# Altium project SmartMeter-multi.PrjPCB (part 1 of 2)
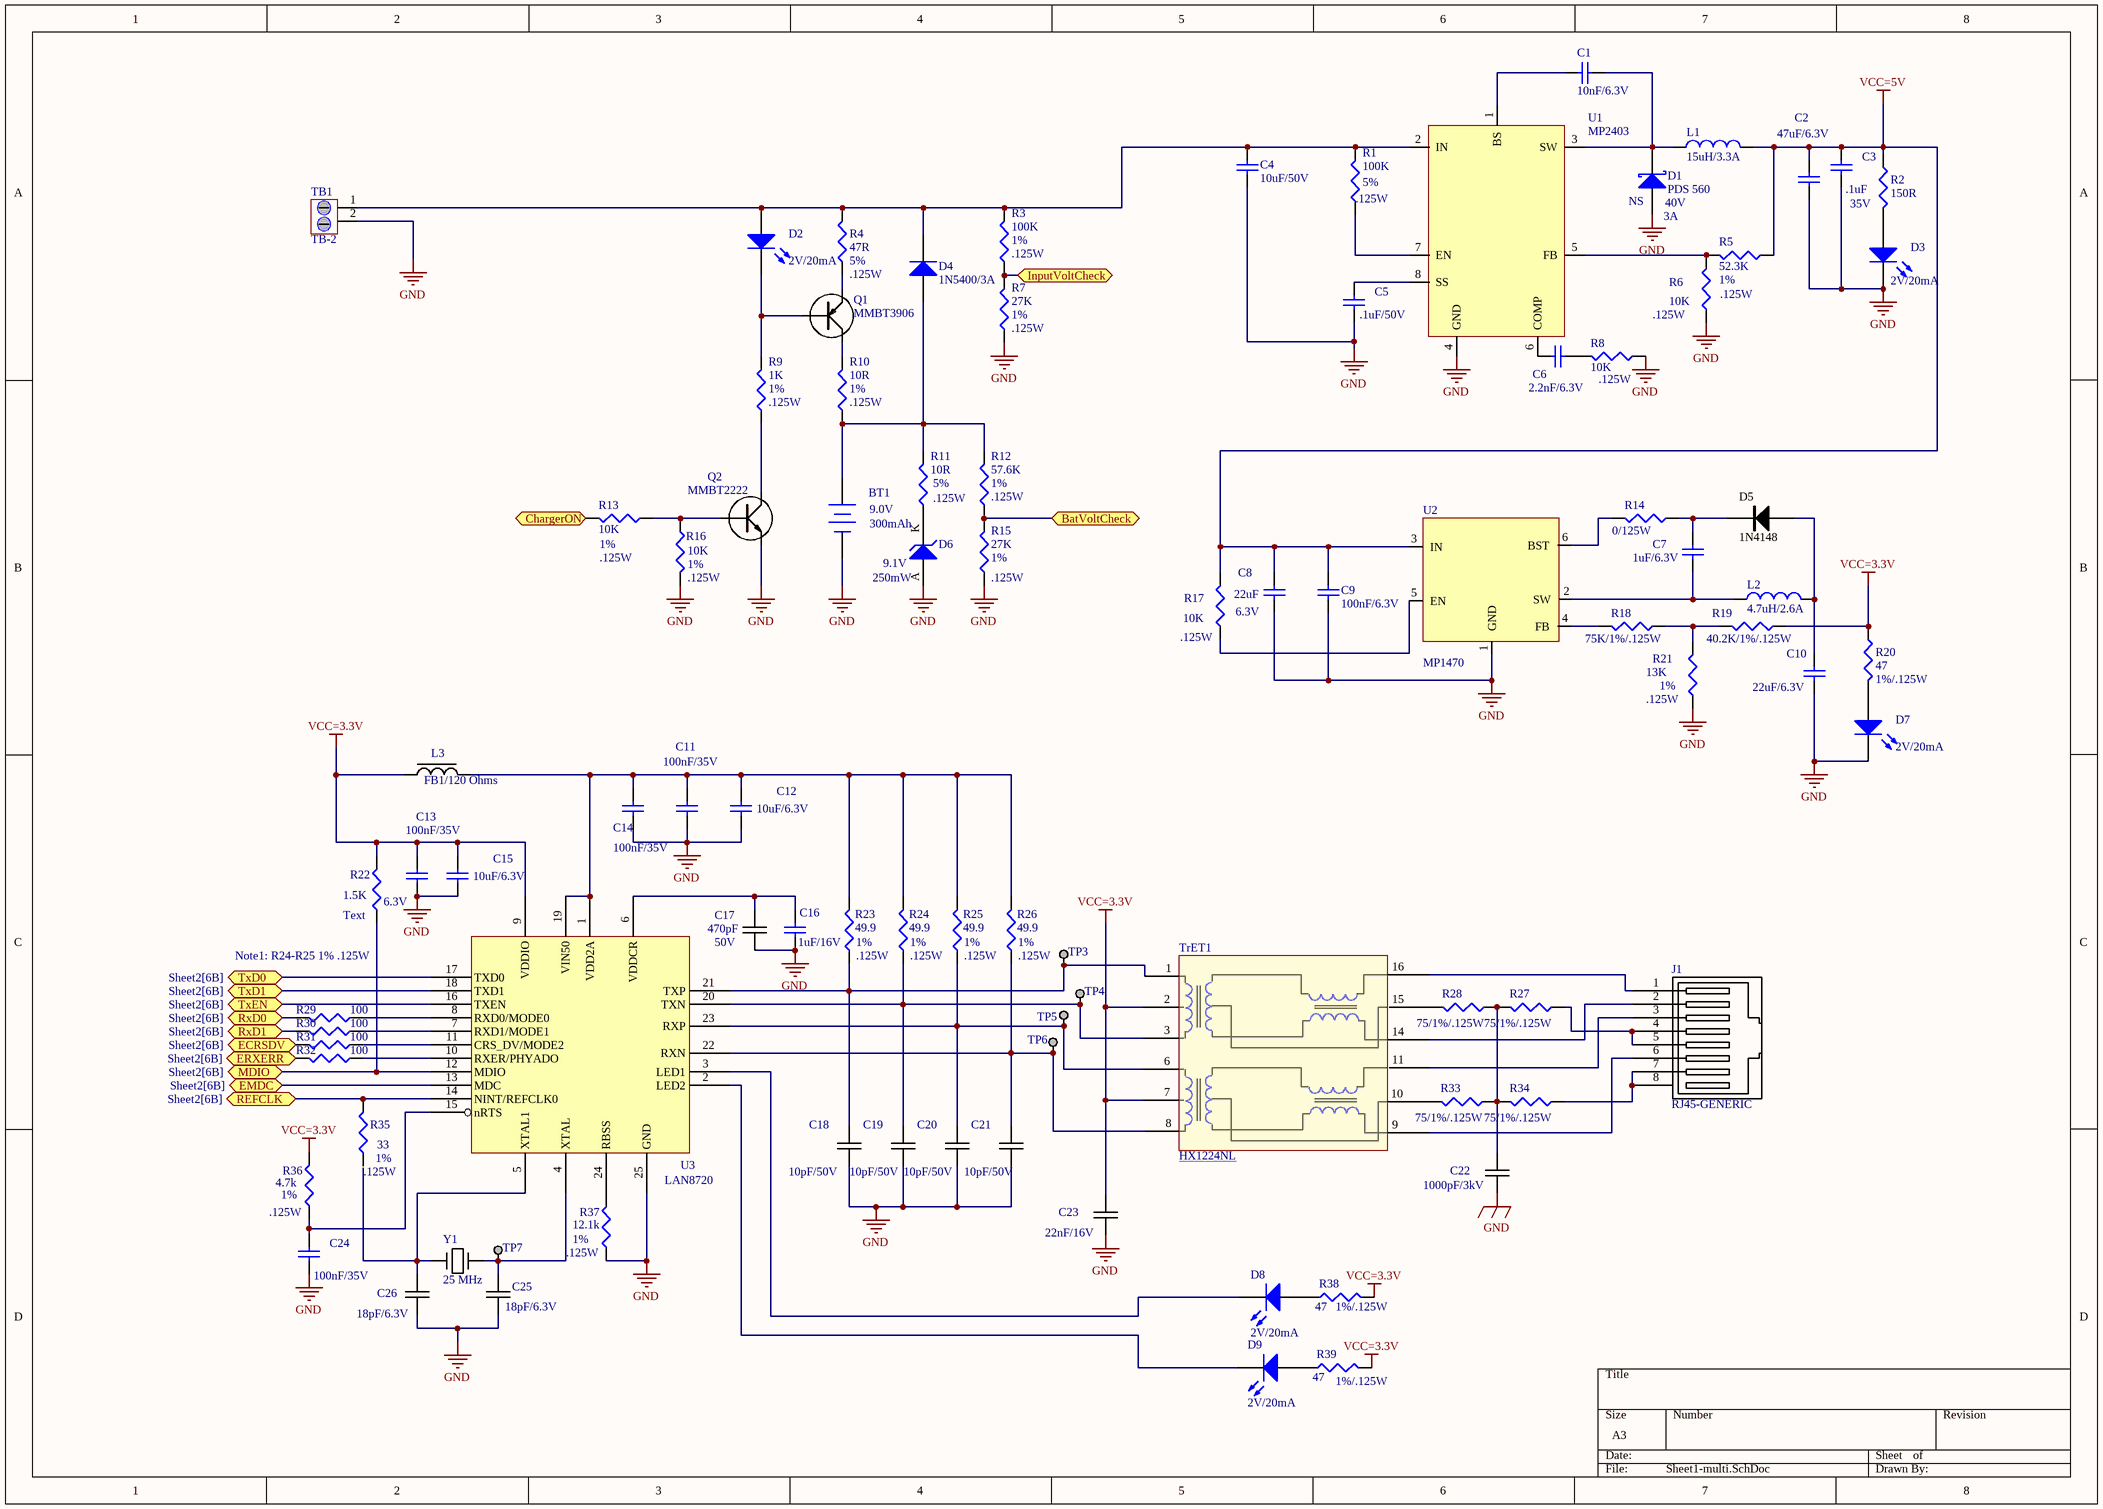
[diagram p0: Sheet1-multi.SchDoc]
3 sheets, 331 parts. Net scope: flat (ports and power ports of the same name join across sheets).
Board files: PCB-SM-multi.PcbDoc, SM-sketch2.PcbDoc, SM-sketch.PcbDoc
Sheets:
  Sheet1-multi.SchDoc
  Sheet2-multi.SchDoc
  Sheet3-multi.SchDoc

## Sheet Sheet1-multi.SchDoc: SMART METER - MainBoard
size A3; SheetNumber: 1

### Parts
BT1  9.0V  [BAT-2]
C1  10nF/6.3V  [0402C-GENERIC]
C2  47uF/6.3V  [1210C-GENERIC]
C3  .1uF  [0402C-GENERIC]
C4  10uF/50V  [1206C-GENERIC]
C5  .1uF/50V  [0402C-GENERIC]
C6  2.2nF/6.3V  [0402C-GENERIC]
C7  1uF/6.3V  [0603C-GENERIC]
C8  22uF  [1206C-GENERIC]
C9  100nF/6.3V  [0805C-GENERIC]
C10  22uF/6.3V  [1206C-GENERIC]
C11  100nF/35V  [0402C-GENERIC]
C12  10uF/6.3V  [0402C-GENERIC]
C13  100nF/35V  [0402C-GENERIC]
C14  100nF/35V  [0402C-GENERIC]
C15  10uF/6.3V  [0402C-GENERIC]
C16  1uF/16V  [0402C-GENERIC]
C17  470pF  [0402C-GENERIC]
C18  10pF/50V  [0402C-GENERIC]
C19  10pF/50V  [0402C-GENERIC]
C20  10pF/50V  [0402C-GENERIC]
C21  10pF/50V  [0402C-GENERIC]
C22  1000pF/3kV  [1808]
C23  22nF/16V  [0402C-GENERIC]
C24  100nF/35V  [0402C-GENERIC]
C25  18pF/6.3V  [0805C-TBD]
C26  18pF/6.3V  [0805C-TBD]
D1  PDS 560  [SMB]
D2  2V/20mA  [LED-SM]
D3  2V/20mA  [LED-SM]
D4  1N5400/3A  [DO-41]
D5  1N4148  [SOD-123]
D6  9.1V  [SOT23-DIODE]
D7  2V/20mA  [LED-SM]
D8  2V/20mA  [LED-SM]
D9  2V/20mA  [LED-SM]
J1  RJ45-GENERIC  [RJ45-8/8]
L1  15uH/3.3A  [Murata 15uH inductor]
L2  4.7uH/2.6A  [Inductor 4.7/6.8]
L3  FB1/120 Ohms  [0603C-2U2]
Q1  MMBT3906  [SOT23-BCE]
Q2  MMBT2222  [MMBT2222]
R1  100K  [0402R-TBD]
R2  150R  [0402R-TBD]
R3  100K  [0402R-TBD]
R4  47R  [0402R-TBD]
R5  52.3K  [0402R-TBD]
R6  10K  [0402R-TBD]
R7  27K  [0402R-TBD]
R8  10K  [0402R-TBD]
R9  1K  [0402R-TBD]
R10  10R  [0402R-TBD]
R11  10R  [0402R-TBD]
R12  57.6K  [0402R-TBD]
R13  10K  [0402R-TBD]
R14  0/125W  [0805R-0R1]
R15  27K  [0402R-TBD]
R16  10K  [0805R-0R1]
R17  10K  [0402R-TBD]
R18  75K/1%/.125W  [0402C-TBD]
R19  40.2K/1%/.125W  [0402R-TBD]
R20  47  [0402R-TBD]
R21  13K  [0402R-TBD]
R22  1.5K  [0402R-TBD]
R23  49.9  [0402R-TBD]
R24  49.9  [0402R-TBD]
R25  49.9  [0402R-TBD]
R26  49.9  [0402R-TBD]
R27  75/1%/.125W  [0402R-TBD]
R28  75/1%/.125W  [0402R-TBD]
R29  100  [0402R-TBD]
R30  100  [0402R-TBD]
R31  100  [0402R-TBD]
R32  100  [0402R-TBD]
R33  75/1%/.125W  [0402R-TBD]
R34  75/1%/.125W  [0402R-TBD]
R35  33  [0402R-TBD]
R36  4.7k  [0402R-TBD]
R37  12.1k  [0402R-TBD]
R38  47  [0402R-TBD]
R39  47  [0402R-TBD]
TB1  TB-2  [Terminal Block 2x5mm]
TP3  TESTPOINT  [TESTPOINT]  (value not drawn)
TP4  TESTPOINT  [TESTPOINT]  (value not drawn)
TP5  TESTPOINT  [TESTPOINT]  (value not drawn)
TP6  TESTPOINT  [TESTPOINT]  (value not drawn)
TP7  TESTPOINT  [TESTPOINT]  (value not drawn)
TrET1  HX1224NL  [S558-5999-Ethtransf]
U1  MP2403  [MP2403]
U2  MP1470  [MP1470]
U3  LAN8720  [QFN24_4X4_N]
Y1  25 MHz  [25Mhz-oscl]

### Ports
BatVoltCheck, ChargerON, ECRSDV (see Sheet2[6B]), EMDC (see Sheet2[6B]), ERXERR (see Sheet2[6B]), InputVoltCheck, MDIO (see Sheet2[6B]), REFCLK (see Sheet2[6B]), RxD0 (see Sheet2[6B]), RxD1 (see Sheet2[6B]), TxD0 (see Sheet2[6B]), TxD1 (see Sheet2[6B]), TxEN (see Sheet2[6B])

### Nets
GND: BT1.2(-) C2.2 C3.2 C4.2 C5.2 C8.2 C9.1 C10.2 C11.2 C12.2 C13.2 C14.2 C15.2 C16.2 C17.2 C18.2 C19.2 C20.2 C21.2 C22.2 C23.2 C24.2 C25.2 C26.2 D1.1(A) D3.2(K) D6.A D7.2(K) Q2.E R6.1 R7.1 R8.1 R15.1 R16.2 R21.1 R37.1 TB1.2 U1.4(GND) U2.1(GND) U3.25(GND)
VCC=3.3V: C13.1 C15.1 C23.1 L3.1 R19.1 R20.1 R22.2 R36.2 R38.2 R39.2 TrET1.2(TDCT) TrET1.7 U3.9(VDDIO)
VCC=5V: C2.1 C3.1 C8.1 C9.2 L1.2 R2.1 R5.1 R17.2 U2.3(IN)
NetBT1_1: BT1.1(+) D4.1(A) R10.1 R11.2 R12.2
NetC1_1: C1.1 U1.1(BS)
NetC1_2: C1.2 D1.2(K) L1.1 U1.3(SW)
NetC4_1: C4.1 D2.1(A) D4.2(K) R1.2 R3.2 R4.2 TB1.1 U1.2(IN)
NetC5_1: C5.1 U1.8(SS)
NetC6_1: C6.1 U1.6(COMP)
NetC6_2: C6.2 R8.2
NetC7_1: C7.1 D5.K R14.1
NetC7_2: C7.2 L2.1 U2.2(SW)
NetC10_1: C10.1 D5.A L2.2
NetC11_1: C11.1 C12.1 C14.1 L3.2 R23.2 R24.2 R25.2 R26.2 U3.1(VDD2A) U3.19(VIN50)
NetC16_1: C16.1 C17.1 U3.6(VDDCR)
NetC18_1: C18.1 R23.1 TP3.1 TrET1.1(TD+) U3.21(TXP)
NetC19_1: C19.1 R24.1 TP4.1 TrET1.3(TD-) U3.20(TXN)
NetC20_1: C20.1 R25.1 TP5.1 TrET1.6 U3.23(RXP)
NetC21_1: C21.1 R26.1 TP6.1 TrET1.8 U3.22(RXN)
NetC22_1: C22.1 R27.2 R28.1 R33.1 R34.2
NetC24_1: C24.1 R36.1 U3.15(nRTS)
NetC25_1: C25.1 TP7.1 U3.4(XTAL) Y1.2
NetC26_1: C26.1 U3.5(XTAL1) Y1.1
NetD2_2: D2.2(K) Q1.B R9.2
NetD3_1: D3.1(A) R2.2
NetD6_K: D6.K R11.1
NetD7_1: D7.1(A) R20.2
NetD8_1: D8.1(A) R38.1
NetD8_2: D8.2(K) U3.3(LED1)
NetD9_1: D9.1(A) R39.1
NetD9_2: D9.2(K) U3.2(LED2)
NetJ1_1: J1.1 TrET1.16(Tx+_16)
NetJ1_2: J1.2 TrET1.14
NetJ1_3: J1.3 TrET1.11
NetJ1_4: J1.4 J1.5 R27.1
NetJ1_6: J1.6 TrET1.9
NetJ1_7: J1.7 J1.8 R34.1
NetQ1_C: Q1.C R10.2
NetQ1_E: Q1.E R4.1
NetQ2_B: Q2.B R13.1 R16.1
NetQ2_C: Q2.C R9.1
NetR1_1: R1.1 U1.7(EN)
NetR3_1: R3.1 R7.2 ; port InputVoltCheck
NetR5_2: R5.2 R6.2 U1.5(FB)
NetR12_1: R12.1 R15.2 ; port BatVoltCheck
NetR13_2: R13.2 ; port ChargerON
NetR14_2: R14.2 U2.6(BST)
NetR17_1: R17.1 U2.5(EN)
NetR18_1: R18.1 R19.2 R21.2
NetR18_2: R18.2 U2.4(FB)
NetR22_1: R22.1 U3.12(MDIO) ; port MDIO
NetR28_2: R28.2 TrET1.15
NetR29_1: R29.1 U3.8(RXD0/MODE0)
NetR29_2: R29.2 ; port RxD0
NetR30_1: R30.1 U3.7(RXD1/MODE1)
NetR30_2: R30.2 ; port RxD1
NetR31_1: R31.1 U3.11(CRS_DV/MODE2)
NetR31_2: R31.2 ; port ECRSDV
NetR32_1: R32.1 U3.10(RXER/PHYADO)
NetR32_2: R32.2 ; port ERXERR
NetR33_2: R33.2 TrET1.10
NetR35_2: R35.2 U3.14(NINT/REFCLK0) ; port REFCLK
NetR37_2: R37.2 U3.24(RBSS)
NetU3_13: U3.13(MDC) ; port EMDC
NetU3_16: U3.16(TXEN) ; port TxEN
NetU3_17: U3.17(TXD0) ; port TxD0
NetU3_18: U3.18(TXD1) ; port TxD1

Not connected (* = marked no-connect by the designer): R35 1

### Notes on the sheet
- (near R3) 1%
- (near R1) .125W
- (near R1) 5%
- (near D1) NS
- (near D1) 3A
- (near D1) 40V
- 35V
- (near R4) 5%
- (near R4) .125W
- (near R3) .125W
- (near R7) 1%
- .125W
- 1%
- (near R6) .125W
- (near R7) .125W
- (near R8) .125W
- (near R9) 1%
- (near R9) .125W
- (near R10) 1%
- (near R10) .125W
- (near R11) 5%
- (near R11) .125W
- (near R12) 1%
- (near R12) .125W
- (near R13) 1%
- (near R16) 1%
- (near R16) .125W
- 300mAh
- (near D6) 250mW
- (near R15) 1%
- (near R15) .125W
- (near R17) .125W
- 6.3V
- (near R21) .125W
- (near R21) 1%
- (near R20) 1%/.125W
- (near R22) Text
- (near R22) 6.3V
- Note1: R24-R25 1% .125W
- 50V
- (near R23) 1%
- (near R23) .125W
- (near R24) 1%
- (near R24) .125W
- (near R25) 1%
- (near R25) .125W
- (near R26) 1%
- (near R26) .125W
- (near R35) .125W
- (near R35) 1%
- (near R36) .125W
- (near R36) 1%
- (near R37) .125W
- (near R37) 1%
- (near R38) 1%/.125W
- (near R39) 1%/.125W

### Library data of the parts
BT1 = Battery: Multicell Battery; Manufacturer: Guangdons China; Published: 24-Mar-1999; LatestRevisionDate: 17-Jul-2002; LatestRevisionNote: Re-released for DXP Platform.; PackageReference: BAT-2; Publisher: sunbangpower.en.alibaba.com; PackageDescription: Battery; 2 Leads; Supplier: Zoro; Price: 1
C1 = Cap: Capacitor; Manufacturer: Murata; Mfr.PN#: 490-6286-1-ND; Value: 100n; Published: 8-Jun-2000; LatestRevisionDate: 17-Jul-2002; LatestRevisionNote: Re-released for DXP Platform.; PackageReference: 0402; Publisher: Altium Limited; PackageDescription: Radial Cap, Thru-Hole; 2 Leads; 0.3 in Pin Spacing; Supplier: Digi-Key; Suppl.PN#: 490-6286-1-ND; Price: .049; Footprint: 0603
C2 = Cap: Capacitor; Manufacturer: Murata; Mfr.PN#: GRM32ER70J476KE20L; Value: 47uF; Suppl.PN#: 490-5311-1-ND; Published: 8-Jun-2000; LatestRevisionDate: 17-Jul-2002; LatestRevisionNote: Re-released for DXP Platform.; PackageReference: 0402; Publisher: Altium Limited; PackageDescription: Radial Cap, Thru-Hole; 2 Leads; 0.3 in Pin Spacing; Supplier: Digi-Key; Price: .049; Footprint: 0603
C3 C11 C13 C14 C24 = Cap: Capacitor; Manufacturer: Yaiyo Yuden; Mfr.PN#: GMK105BJ104KV-F; Value: 100n; Suppl.PN#: 587-1994-1-ND; Published: 8-Jun-2000; LatestRevisionDate: 17-Jul-2002; LatestRevisionNote: Re-released for DXP Platform.; PackageReference: 0402; Publisher: Altium Limited; PackageDescription: Radial Cap, Thru-Hole; 2 Leads; 0.3 in Pin Spacing; Supplier: Digi-Key; Price: .049; Footprint: 0603
C4 = Cap: Capacitor; Manufacturer: Murata; Mfr.PN#: GRM31CR61H106KA12L; Suppl.PN#: 490-5961-1-ND; Published: 8-Jun-2000; PackageReference: RAD-0.3; Publisher: Altium Limited; LatestRevisionDate: 17-Jul-2002; LatestRevisionNote: Re-released for DXP Platform.; PackageDescription: Radial Cap, Thru-Hole; 2 Leads; 0.3 in Pin Spacing; Supplier: DigiKey
C5 = Cap: Capacitor; Manufacturer: Murata; Mfr.PN#: CL05B104KO5NNNC; Value: 100n; Suppl.PN#: 1276-1001-6-ND; Published: 8-Jun-2000; LatestRevisionDate: 17-Jul-2002; LatestRevisionNote: Re-released for DXP Platform.; PackageReference: 0402; Publisher: Altium Limited; PackageDescription: Radial Cap, Thru-Hole; 2 Leads; 0.3 in Pin Spacing; Supplier: Digi-Key; Price: .049; Footprint: 0603
C6 = Cap: Capacitor; Manufacturer: Murata; Mfr.PN#: GRM155R60J222KA01D; Value: 100n; Suppl.PN#: 490-11413-1-ND; Published: 8-Jun-2000; LatestRevisionDate: 17-Jul-2002; LatestRevisionNote: Re-released for DXP Platform.; PackageReference: 0402; Publisher: Altium Limited; PackageDescription: Radial Cap, Thru-Hole; 2 Leads; 0.3 in Pin Spacing; Supplier: Digi-Key; Price: .049; Footprint: 0603
C7 = Cap: Capacitor; Manufacturer: TDK Corporation; Mfr.PN#: CGJ3E2X7R1C103K080AA; Value: 10n; Suppl.PN#: 445-8130-1-ND; Published: 8-Jun-2000; LatestRevisionDate: 17-Jul-2002; LatestRevisionNote: Re-released for DXP Platform.; PackageReference: RAD-0.3; Publisher: Altium Limited; PackageDescription: Radial Cap, Thru-Hole; 2 Leads; 0.3 in Pin Spacing; Supplier: Digi-Key; Price: .049; Footprint: 0603
C8 C10 = Cap: Capacitor; Manufacturer: Murata; Mfr.PN#: GRM31CR60J226KE19L; Value: 100n; Suppl.PN#: 490-1824-2-ND; Published: 8-Jun-2000; LatestRevisionDate: 17-Jul-2002; LatestRevisionNote: Re-released for DXP Platform.; PackageReference: 0402; Publisher: Altium Limited; PackageDescription: Radial Cap, Thru-Hole; 2 Leads; 0.3 in Pin Spacing; Supplier: Digi-Key; Price: .049; Footprint: 0603
C9 = Cap: Capacitor; Manufacturer: Kemet; Mfr.PN#: C0805C104K9RACTU; Value: 100n; Suppl.PN#: 399-9155-1-ND; Published: 8-Jun-2000; LatestRevisionDate: 17-Jul-2002; LatestRevisionNote: Re-released for DXP Platform.; PackageReference: 0402; Publisher: Altium Limited; PackageDescription: Radial Cap, Thru-Hole; 2 Leads; 0.3 in Pin Spacing; Supplier: Digi-Key; Price: .049; Footprint: 0603
C12 C15 = Cap: Capacitor; Manufacturer: Murata; Mfr.PN#: GRM155R60J106ME15D; Suppl.PN#: 490-13238-6-ND; Published: 8-Jun-2000; LatestRevisionDate: 17-Jul-2002; LatestRevisionNote: Re-released for DXP Platform.; PackageReference: 0402; Publisher: Altium Limited; PackageDescription: Radial Cap, Thru-Hole; 2 Leads; 0.3 in Pin Spacing; Value: 10uF/6.3V; Supplier: Digi-Key; Price: .049; Footprint: 0603
C16 = Cap: Capacitor; Manufacturer: TDK Corporation; Mfr.PN#: C1005X5R1C105K050BC; Value: 1uF/6.3V; Suppl.PN#: 445-4978-1-ND; Published: 8-Jun-2000; LatestRevisionDate: 17-Jul-2002; LatestRevisionNote: Re-released for DXP Platform.; PackageReference: 0402; Publisher: Altium Limited; PackageDescription: Radial Cap, Thru-Hole; 2 Leads; 0.3 in Pin Spacing; Supplier: Digi-Key; Price: .049; Footprint: 0603
C17 = 0805C-18PF-50V-C0G-JOH: CAPACITOR 0805 CERAMIC; Manufacturer: Murata; Mfr.PN#: GRM1555C1H471JA01D; Value: 470pF 50V; Suppl.PN#: 490-1297-1-ND; Supplier 1: Digi-Key; Supplier Part Number 1: 709-1171-2-ND; Supplier: Digi-Key; SMD: 0402; Price: 0.1
C18-C21 = 0805C-18PF-50V-C0G-JOH: CAPACITOR 0805 CERAMIC; Manufacturer: Murata; Mfr.PN#: GRM1555C1H100FA01D; Suppl.PN#: 490-6186-1-ND; Supplier 1: Digi-Key; Supplier Part Number 1: 709-1171-2-ND; Value: 10pF/50V; Supplier: Digi-Key; Price: .03; SMD: 0402
C22 = 0805C-18PF-50V-C0G-JOH: CAPACITOR 1808CERAMIC; Manufacturer: Johanson Dielctrics Inc; Mfr.PN#: 302R29W102KV4E; Value: 1000pF; Suppl.PN#: 709-1047-1-ND; Supplier 1: Digi-Key; Supplier Part Number 1: 709-1171-2-ND; Supplier: 490-5407-6-ND; SMD: 1801; Price: .0096
C23 = 0805C-18PF-50V-C0G-JOH: CAPACITOR 0805 CERAMIC; Manufacturer: Murata Electronics; Mfr.PN#: GRM155R71H223KA12D; Value: 22nF; Suppl.PN#: 490-3884-1-ND; Supplier 1: Digi-Key; Supplier Part Number 1: 709-1171-2-ND; Supplier: 490-5407-6-ND; SMD: 0402; Price: .0096
C25 C26 = 0805C-18PF-50V-C0G-JOH: CAPACITOR 0805 CERAMIC; Manufacturer: Kemet; Mfr.PN#: CBR02C180F9GAC; Suppl.PN#: CBR02C180F9GAC-ND; Supplier 1: Digi-Key; Supplier Part Number 1: 709-1171-2-ND; Value: 18pF/6.3V; Supplier: Digi-Key; Price: .03; SMD: 0603
D1 = D Schottky: Schottky Diode; Manufacturer: Diodes Incorporated; Mfr.PN#: PDS560-13; Suppl.PN#: 621-PDS560-F; Published: 8-Jun-2000; LatestRevisionDate: 17-Jul-2002; LatestRevisionNote: Re-released for DXP Platform.; PackageReference: SMB; Publisher: Altium Limited; PackageDescription: DO-214-AA/SMB; 2 C-Bend Leads; Body 5.3 x 3.6 mm, inc. leads (LxW); Code_JEDEC: DO-214-AA; Supplier: Mouser
D2 D3 D7-D9 = LED2: Typical RED, GREEN, YELLOW, AMBER GaAs LED; Manufacturer: Lite-On Inc; Mfr.PN#: LTST-C191KGKT; Suppl.PN#: 160-1446-2-ND; Published: 8-Jun-2000; LatestRevisionDate: 17-Jul-2002; LatestRevisionNote: Re-released for DXP Platform.; PackageVersion: Feb-2002; PackageReference: 3.2X1.6X1.1; Publisher: Altium Limited; PackageDescription: SM LED; 2 Flat Leads; Supplier: Digi-Key; Price: .04
D4 = Diode 1N4007: 1 Amp General Purpose Rectifier; Manufacturer: NTE Electronics; Mfr.PN#: !n5400; Suppl.PN#: 33C7853; Published: 8-Jun-2000; LatestRevisionDate: 17-Jul-2002; LatestRevisionNote: Re-released for DXP Platform.; DatasheetVersion: 1998; PackageVersion: Aug-1999; PackageReference: DO-41; Publisher: Altium Limited; PackageDescription: Diode, Axial; Body 5.2 x 2.7 mm (LxDia. max), Lead Dia. 0.86 mm (max); Code_JEDEC: DO-204-AL; ComponentLink1Description: Manufacturer Link; ComponentLink1URL: http://www.fairchildsemi.com/; ComponentLink2Description: Datasheet; ComponentLink2URL: http://www.fairchildsemi.com/ds/1N%2F1N4001.pdf; Supplier: Newark; Price: .142
D5 = 1N4001: Manufacturer: Vishay; Mfr.PN#: 1N4148W-E3-18; Suppl.PN#: 1N4148W-E3-18CT-ND; Supplier: Digikey
D6 = D Zener: Zener Diode; Manufacturer: NXP Semi; Mfr.PN#: BZX84-C9V1,235; Suppl.PN#: MMBT3906LT1G; Published: 8-Jun-2000; LatestRevisionDate: 17-Jul-2002; LatestRevisionNote: Re-released for DXP Platform.; PackageReference: DIODE-0.7; Publisher: Altium Limited; PackageDescription: Diode, Thru-Hole; 2 Leads; 0.7 in Pin Spacing; Supplier: DigiKey
J1 = RJ45-GENERIC: GENERIC RJ45 CONNECTOR 8 PIN; Manufacturer: Assman WSW Components; Mfr.PN#: A-2004-2-4-LP-N-R; Suppl.PN#: AE10384-ND; Supplier: DigiKey
L1 = Inductor: Manufacturer: Murata; Mfr.PN#: 1217AS-H-150M=P3; Code_IEC: 1005; Value: 15uH; Suppl.PN#: 490-10784-1-ND; Published: 8-Jun-2000; LatestRevisionDate: 29-May-2009; LatestRevisionNote: IPC-7351 Footprint Added.; PackageReference: 0402-A; Publisher: Altium Limited; PackageDescription: Chip Inductor; Code_JEITA: 0402; Supplier: DigiKey; Price: .82
L2 = Inductor: Manufacturer: Bourns; Mfr.PN#: SDR7045-6R8M; Code_IEC: 1005; Value: 4.7uH; Suppl.PN#: 490-10791-1-ND; Published: 8-Jun-2000; LatestRevisionDate: 29-May-2009; LatestRevisionNote: IPC-7351 Footprint Added.; PackageReference: 0402-A; Publisher: Altium Limited; PackageDescription: Chip Inductor; Code_JEITA: 0402; mfr PN: *; Supplier: DigiKey; Price: .82
L3 = 1U-1239AS-TOKO: 1239AS-H-1R0N; Mfr.PN#: BLM18PG121SN1D; Manufacturer: Murata Electronics; Suppl.PN#: 490-1037-1-ND; Supplier: Digi-Key; Price: .288; SMD: look at dsheet
Q1 = PNP-GENERIC: GENERIC PNP BIPOLAR TRANSISTOR; Manufacturer: On Semi; Mfr.PN#: MMBT3906LT1G; Suppl.PN#: MMBT3906LT1GOSCT-ND; Supplier: DigiKey
Q2 = MMBT2222: BC847 SMALL SIGNAL NPN TRANSISTOR; Manufacturer: Diodes  Inc.; Mfr.PN#: MMBT2222A-7-F; Suppl.PN#: MMBT2222A-FDICT-ND; Supplier 1: Digi-Key; Supplier: Digi-Key; Package: SOT-323; Price: .03
R1 R3 = Res3: Resistor; Manufacturer: Panasonic; Mfr.PN#: ERJ-2RKF1003X; Suppl.PN#: P100KLCT-ND; Published: 8-Jun-2000; LatestRevisionDate: 29-May-2009; LatestRevisionNote: IPC-7351 Footprint Added.; PackageReference: 0805; Publisher: Altium Limited; PackageDescription: Chip Resistor; Value: 100K; Supplier: DigiKey; Price: .0035
R2 = Res3: Resistor; mfr PN: ERJ-2RKF1500X; Manufacrturer: Panasonic; Mfr.PN#: CRCW080545R0FKTA; Value: 45/.125/1%; Suppl.PN#: P150LCT-ND; Published: 8-Jun-2000; LatestRevisionDate: 29-May-2009; LatestRevisionNote: IPC-7351 Footprint Added.; PackageReference: 0805; Publisher: Altium Limited; PackageDescription: Chip Resistor; Supplier: Digi-Key
R4 = Res3: Resistor; Manufacturer: Stackpole Electronics Inc; Mfr.PN#: RMCF0402FT47R0; Suppl.PN#: RMCF0402FT47R0CT-ND; Published: 8-Jun-2000; LatestRevisionDate: 29-May-2009; LatestRevisionNote: IPC-7351 Footprint Added.; PackageReference: 0402; Publisher: Altium Limited; PackageDescription: Chip Resistor; Value: 47R; Supplier: DigiKey; Price: .0035
R5 = Res3: Resistor; Manufacturer: Panasonic; Mfr.PN#: ERJ-2RKF5232X; Value: 52.5K; Suppl.PN#: P52.3KLCT-ND; Published: 8-Jun-2000; LatestRevisionDate: 29-May-2009; LatestRevisionNote: IPC-7351 Footprint Added.; PackageReference: 0805; Publisher: Altium Limited; PackageDescription: Chip Resistor; Supplier: Digi-Key; Price: .0035
R6 R8 R13 R17 = Res3: Resistor; Manufacturer: Panasonic; Mfr.PN#: ERJ-2RKF1002X; Value: 100K; Suppl.PN#: P10.0KLTR-ND; Published: 8-Jun-2000; LatestRevisionDate: 29-May-2009; LatestRevisionNote: IPC-7351 Footprint Added.; PackageReference: 0805; Publisher: Altium Limited; PackageDescription: Chip Resistor; Supplier: Digi-Key; Price: .0035
R7 R15 = Res3: Resistor; Manufacturer: Panasonic; Mfr.PN#: ERJ-2RKF2702X; Suppl.PN#: P27.0KLDKR-ND; Published: 8-Jun-2000; LatestRevisionDate: 29-May-2009; LatestRevisionNote: IPC-7351 Footprint Added.; PackageReference: 0805; Publisher: Altium Limited; PackageDescription: Chip Resistor; Value: 27K; Supplier: DigiKey; Price: .0035
R9 = Res3: Resistor; Manufacturer: Panasonic; Mfr.PN#: ERJ-2RKF1001X; Suppl.PN#: P1.00KLCT-ND; Published: 8-Jun-2000; LatestRevisionDate: 29-May-2009; LatestRevisionNote: IPC-7351 Footprint Added.; PackageReference: 0805; Publisher: Altium Limited; PackageDescription: Chip Resistor; Value: 1K; Supplier: DigiKey; Price: .0035
R10 R11 = Res3: Resistor; Manufacturer: Panasonic; Mfr.PN#: ERJ-2RKF10R0X; Suppl.PN#: P10.0LDKR-ND; Published: 8-Jun-2000; LatestRevisionDate: 29-May-2009; LatestRevisionNote: IPC-7351 Footprint Added.; PackageReference: 0402; Publisher: Altium Limited; PackageDescription: Chip Resistor; Value: 10R; Supplier: DigiKey; Price: .0035
R12 = Res3: Resistor; Manufacturer: Panasonic; Mfr.PN#: ERJ-2RKF57R6X; Suppl.PN#: P57.6LCT-ND; Published: 8-Jun-2000; LatestRevisionDate: 29-May-2009; LatestRevisionNote: IPC-7351 Footprint Added.; PackageReference: 0805; Publisher: Altium Limited; PackageDescription: Chip Resistor; Value: 57.6K; Supplier: DigiKey; Price: .0035
R14 = Res3: Resistor; Manufacturer: Vishay Dale; Mfr.PN#: RCA0805100KFKEA; Value: 100K; Suppl.PN#: 541-2230-1-ND; Published: 8-Jun-2000; LatestRevisionDate: 29-May-2009; LatestRevisionNote: IPC-7351 Footprint Added.; PackageReference: 0805; Publisher: Altium Limited; PackageDescription: Chip Resistor; Supplier: Digi-Key; Price: .0035
R16 = Res3: Resistor; Manufacturer: Samsung; Mfr.PN#: RC2012103S; Suppl.PN#: 1276-5332-1-ND; Published: 8-Jun-2000; LatestRevisionDate: 29-May-2009; LatestRevisionNote: IPC-7351 Footprint Added.; PackageReference: 0805; Publisher: Altium Limited; PackageDescription: Chip Resistor; Value: 10K; Supplier: DigiKey; Price: .0035
R18 = Res3: Resistor; Manufacturer: Panasonic; Mfr.PN#: ERJ-2GEJ753X; Value: 75K; Suppl.PN#: P75KJDKR-ND; Published: 8-Jun-2000; LatestRevisionDate: 29-May-2009; LatestRevisionNote: IPC-7351 Footprint Added.; PackageReference: 0805; Publisher: Altium Limited; PackageDescription: Chip Resistor; Supplier: Digikey; Price: .0035
R19 = Res3: Resistor; Manufacturer: Panasonic; Mfr.PN#: ERJ-2RKF4022X; Value: 100K; Suppl.PN#: P40.2KLCT-ND; Published: 8-Jun-2000; LatestRevisionDate: 29-May-2009; LatestRevisionNote: IPC-7351 Footprint Added.; PackageReference: 0805; Publisher: Altium Limited; PackageDescription: Chip Resistor; Supplier: DigiKey; Price: .0035
R20 = Res3: Resistor; mfr PN: ERJ-2RKF47R0X; Manufacrturer: Panasonic; Mfr.PN#: ERJ-6ENF47R0V; Value: 45/.125/1%; Suppl.PN#: P47.0LCT-ND; Published: 8-Jun-2000; LatestRevisionDate: 29-May-2009; LatestRevisionNote: IPC-7351 Footprint Added.; PackageReference: 0805; Publisher: Altium Limited; PackageDescription: Chip Resistor; Supplier: Digi-Key
R21 = Res3: Resistor; Manufacturer: Panasonic; Mfr.PN#: ERJ-2RKF1302X; Suppl.PN#: P13.0KLCT-ND; Published: 8-Jun-2000; LatestRevisionDate: 29-May-2009; LatestRevisionNote: IPC-7351 Footprint Added.; PackageReference: 0805; Publisher: Altium Limited; PackageDescription: Chip Resistor; Value: 13K; Supplier: DigiKey; Price: .0035
R22 = Res3: Resistor; Manufacturer: Panasonic; Mfr.PN#: ERJ-2RKF1501X; Value: 1.5k/ .125W /1%; Suppl.PN#: P1.50KLDKR-ND; Published: 8-Jun-2000; LatestRevisionDate: 29-May-2009; LatestRevisionNote: IPC-7351 Footprint Added.; PackageReference: J1-0603; Publisher: Altium Limited; PackageDescription: Chip Resistor; Supplier: Digi-Key; Price: .00266
R23-R26 = Res3: Resistor; Manufacturer: Panasonic; Mfr.PN#: ERJ-2RKF49R9X; Value: 49.9 .125W 1%; Suppl.PN#: P49.9LCT-ND; Published: 8-Jun-2000; LatestRevisionDate: 29-May-2009; LatestRevisionNote: IPC-7351 Footprint Added.; PackageReference: 0805; Publisher: Altium Limited; PackageDescription: Chip Resistor; Supplier: Digi-Key; Price: .0026
R27 R28 R33 R34 = Res3: Resistor; Manufacturer: Panasonic; Mfr.PN#: ERJ-2RKF75R0X; Value: 75 1% .125; Suppl.PN#: P75.0LCT-ND; Published: 8-Jun-2000; LatestRevisionDate: 29-May-2009; LatestRevisionNote: IPC-7351 Footprint Added.; PackageReference: 0805; Publisher: Altium Limited; PackageDescription: Chip Resistor; Supplier: Digi-Key; Price: .0026
R29-R32 = Res3: Resistor; Manufacturer: Panasonic; Mfr.PN#: ERJ-2RKF1000X; Value: 100 .125W 1%; Suppl.PN#: P100LCT-ND; Published: 8-Jun-2000; LatestRevisionDate: 29-May-2009; LatestRevisionNote: IPC-7351 Footprint Added.; PackageReference: 0805; Publisher: Altium Limited; PackageDescription: Chip Resistor; Supplier: Digi-Key; Price: .1
R35 = Res3: Resistor; Manufacturer: Panasonic; Mfr.PN#: ERJ-2RKF33R0X; Value: 33/ .125W 1%; Suppl.PN#: P33.0LDKR-ND; Published: 8-Jun-2000; LatestRevisionDate: 29-May-2009; LatestRevisionNote: IPC-7351 Footprint Added.; PackageReference: J1-0603; Publisher: Altium Limited; PackageDescription: Chip Resistor; Supplier: Digi-Key; Price: .1
R36 = Res3: Resistor; Manufacturer: Panasonic; Mfr.PN#: ERJ-2RKF4701X; Value: 4.7k/ .125W 1%; Suppl.PN#: P4.70KLCT-ND; Published: 8-Jun-2000; LatestRevisionDate: 29-May-2009; LatestRevisionNote: IPC-7351 Footprint Added.; PackageReference: J1-0603; Publisher: Altium Limited; PackageDescription: Chip Resistor; Supplier: Digi-Key; Price: .1
R37 = Res3: Resistor; Manufacturer: Panasonic; Mfr.PN#: ERJ-2RKF1212X; Value: 12.1k/ .125W 1%; Suppl.PN#: P12.1KLCT-ND; Published: 8-Jun-2000; LatestRevisionDate: 29-May-2009; LatestRevisionNote: IPC-7351 Footprint Added.; PackageReference: 0603; Publisher: Altium Limited; PackageDescription: Chip Resistor; Supplier: Digi-Key; Price: .1
R38 R39 = Res3: Resistor; mfr PN: ERJ-2RKF47R0X; Manufacrturer: Panasonic; Mfr.PN#: CRCW080545R0FKTA; Value: 45/.125/1%; Suppl.PN#: P47.0LCT-ND; Published: 8-Jun-2000; LatestRevisionDate: 29-May-2009; LatestRevisionNote: IPC-7351 Footprint Added.; PackageReference: 0805; Publisher: Altium Limited; PackageDescription: Chip Resistor; Supplier: Digi-Key
TB1 = TB-2: Manufacturer: On Store Technology; Mfr.PN#: OSTTJ027150; Suppl.PN#: ED2779-ND; Supplier: DigiKey
TP3-TP7 = TESTPOINT: TESTPOINT SCOPE GRABBER; Manufacturer Part Number: 5010; Manufacturer: Keystone Electronics; Reel: TH; Supplier 1: Digi-Key; Supplier Part Number 1: 5010K-ND
TrET1 = S558-5999-Eth.TR: Manufacturer: Bel Fuse Inc; Suppl.PN#: 507-1463-1-ND; Supplier: DigiKey; Mfr.PN#: HX1224NL
U1 = MP2403: Manufacturer: MPS Inc; Mfr.PN#: MP2403DN-LF-Z; Suppl.PN#: MP2403DN-LF-Z-ND; Supplier: Digikey
U2 = MP1470: Manufacturer: MPS Inc; Mfr.PN#: MP1470GJ-P; Suppl.PN#: 1589-1018-1-ND; Supplier: DigiKey
U3 = LAN8720: Manufacturer: Microchip; Mfr.PN#: LAN8720A-CP-TR; Suppl.PN#: LAN8720A-CP-CT-ND; Supplier: Digi-key; Price: .76; SMD: 24 QFN
Y1 = CRYSTAL-GENERIC: GENERIC CRYSTAL; Manufacturer: Arbacon; Mfr.PN#: ABM7-25.000MHZ-D2Y-T; Suppl.PN#: 535-9847-1-ND; Value: 25 Mhz; Supplier: Digi-Key; Price: .4288

## Sheet Sheet2-multi.SchDoc: SMART METER Main Board
size A3; SheetNumber: 2
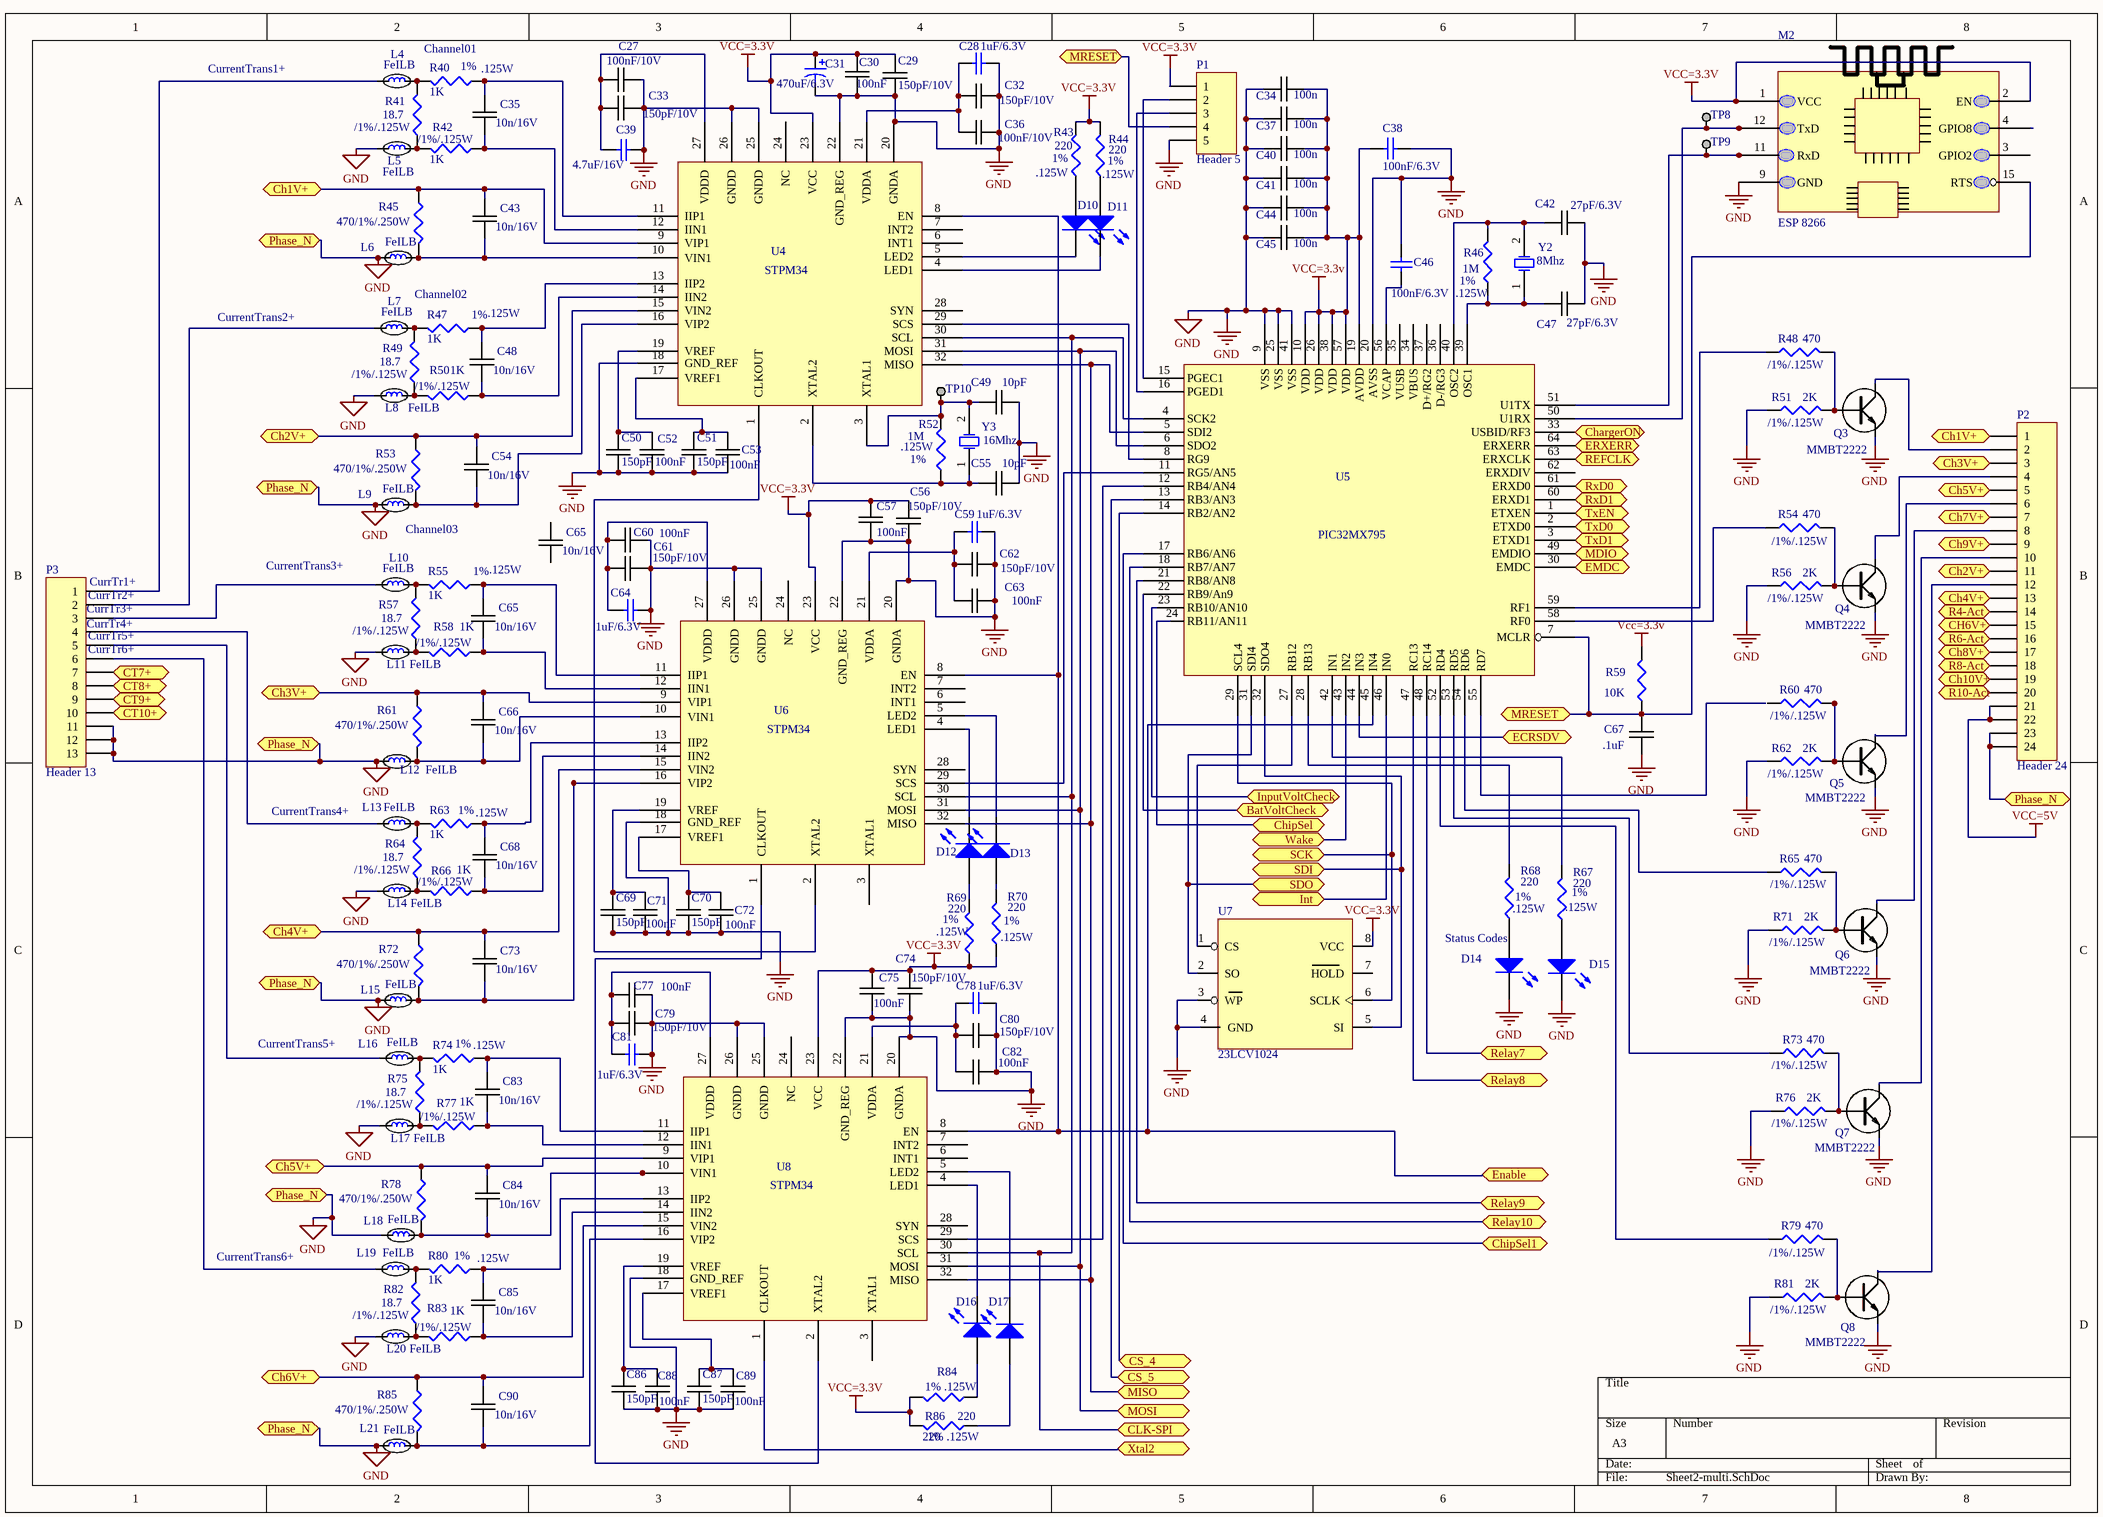
[diagram p1: Sheet2-multi.SchDoc]

### Parts
(Parts that share a designator on the sheet are numbered #1, #2 ... from top to bottom, then left to right.)
C27  100nF/10V  [0402C-GENERIC]
C28  1uF/6.3V  [0402C-GENERIC]
C29  150pF/10V  [0402C-GENERIC]
C30  100nF  [0402C-GENERIC]
C31  470uF/6.3V  [470uF/6.3v]
C32  150pF/10V  [0402C-GENERIC]
C33  150pF/10V  [0402C-GENERIC]
C34  100n  [0805C-TBD]
C35  10n/16V  [0402C-GENERIC]
C36  100nF/10V  [0402C-GENERIC]
C37  100n  [0805C-TBD]
C38  100nF/6.3V  [0805C-GENERIC]
C39  4.7uF/16V  [0402C-GENERIC]
C40  100n  [0805C-TBD]
C41  100n  [0805C-TBD]
C42  27pF/6.3V  [0402C-GENERIC]
C43  10n/16V  [0402C-GENERIC]
C44  100n  [0805C-TBD]
C45  100n  [0805C-TBD]
C46  100nF/6.3V  [0805C-GENERIC]
C47  27pF/6.3V  [0402C-GENERIC]
C48  10n/16V  [0402C-GENERIC]
C49  10pF  [0402C-TBD]
C50  150pF  [0402C-GENERIC]
C51  150pF  [0402C-GENERIC]
C52  100nF  [0402C-GENERIC]
C53  100nF  [0402C-GENERIC]
C54  10n/16V  [0402C-GENERIC]
C55  10pF  [0402C-TBD]
C56  150pF/10V  [0402C-GENERIC]
C57  100nF  [0402C-GENERIC]
C59  1uF/6.3V  [0402C-GENERIC]
C60  100nF  [0402C-GENERIC]
C61  150pF/10V  [0402C-GENERIC]
C62  150pF/10V  [0402C-GENERIC]
C63  100nF  [0402C-GENERIC]
C64  1uF/6.3V  [0402C-GENERIC]
C65#1  10n/16V  [0402C-GENERIC]
C65#2  10n/16V  [0402C-GENERIC]
C66  10n/16V  [0402C-GENERIC]
C67  .1uF  [0805C-TBD]
C68  10n/16V  [0402C-GENERIC]
C69  150pF  [0402C-GENERIC]
C70  150pF  [0402C-GENERIC]
C71  100nF  [0402C-GENERIC]
C72  100nF  [0402C-GENERIC]
C73  10n/16V  [0402C-GENERIC]
C74  150pF/10V  [0402C-GENERIC]
C75  100nF  [0402C-GENERIC]
C77  100nF  [0402C-GENERIC]
C78  1uF/6.3V  [0402C-GENERIC]
C79  150pF/10V  [0402C-GENERIC]
C80  150pF/10V  [0402C-GENERIC]
C81  1uF/6.3V  [0402C-GENERIC]
C82  100nF  [0402C-GENERIC]
C83  10n/16V  [0402C-GENERIC]
C84  10n/16V  [0402C-GENERIC]
C85  10n/16V  [0402C-GENERIC]
C86  150pF  [0402C-GENERIC]
C87  150pF  [0402C-GENERIC]
C88  100nF  [0402C-GENERIC]
C89  100nF  [0402C-GENERIC]
C90  10n/16V  [0402C-GENERIC]
D10  LED2  [LED-SM]  (value not drawn)
D11  LED2  [LED-SM]  (value not drawn)
D12  LED2  [LED-SM]  (value not drawn)
D13  LED2  [LED-SM]  (value not drawn)
D14  LED2  [LED-SM]  (value not drawn)
D15  LED2  [LED-SM]  (value not drawn)
D16  LED2  [LED-SM]  (value not drawn)
D17  LED2  [LED-SM]  (value not drawn)
L4  FeILB  [0603C-TBD]
L5  FeILB  [0603C-TBD]
L6  FeILB  [0603C-TBD]
L7  FeILB  [0603C-TBD]
L8  FeILB  [0603C-TBD]
L9  FeILB  [0603C-TBD]
L10  FeILB  [0603C-TBD]
L11  FeILB  [0603C-TBD]
L12  FeILB  [0603C-TBD]
L13  FeILB  [0603C-TBD]
L14  FeILB  [0603C-TBD]
L15  FeILB  [0603C-TBD]
L16  FeILB  [0603C-TBD]
L17  FeILB  [0603C-TBD]
L18  FeILB  [0603C-TBD]
L19  FeILB  [0603C-TBD]
L20  FeILB  [0603C-TBD]
L21  FeILB  [0603C-TBD]
M2  ESP 8266  [PCBComponent_1 - duplicate]
P1  Header 5  [HDR1X5]
P2  Header 24  [HDR1X24]
P3  Header 13  [HDR1X13]
Q3  MMBT2222  [MMBT2222]
Q4  MMBT2222  [MMBT2222]
Q5  MMBT2222  [MMBT2222]
Q6  MMBT2222  [MMBT2222]
Q7  MMBT2222  [MMBT2222]
Q8  MMBT2222  [MMBT2222]
R40  1K  [0402R-TBD]
R41  18.7  [0402R-TBD]
R42  1K  [0402R-TBD]
R43  220  [0402C-TBD]
R44  220  [0402C-TBD]
R45  470/1%/.250W  [1206FB-GENERIC]
R46  1M  [0402R-TBD]
R47  1K  [0402R-TBD]
R48  470  [0402R-TBD]
R49  18.7  [0402R-TBD]
R50  1K  [0402R-TBD]
R51  2K  [0402R-TBD]
R52  1M  [0805FB-GENERIC]
R53  470/1%/.250W  [1206FB-GENERIC]
R54  470  [0402R-TBD]
R55  1K  [0402R-TBD]
R56  2K  [0402R-TBD]
R57  18.7  [0402R-TBD]
R58  1K  [0402R-TBD]
R59  10K  [0402R-TBD]
R60  470  [0402R-TBD]
R61  470/1%/.250W  [1206FB-GENERIC]
R62  2K  [0402R-TBD]
R63  1K  [0402R-TBD]
R64  18.7  [0402R-TBD]
R65  470  [0402R-TBD]
R66  1K  [0402R-TBD]
R67  220  [0402C-TBD]
R68  220  [0402C-TBD]
R69  220  [0402C-TBD]
R70  220  [0402C-TBD]
R71  2K  [0402R-TBD]
R72  470/1%/.250W  [1206FB-GENERIC]
R73  470  [0402R-TBD]
R74  1K  [0402R-TBD]
R75  18.7  [0402R-TBD]
R76  2K  [0402R-TBD]
R77  1K  [0402R-TBD]
R78  470/1%/.250W  [1206FB-GENERIC]
R79  470  [0402R-TBD]
R80  1K  [0402R-TBD]
R81  2K  [0402R-TBD]
R82  18.7  [0402R-TBD]
R83  1K  [0402R-TBD]
R84  220  [0402C-TBD]
R85  470/1%/.250W  [1206FB-GENERIC]
R86  220  [0402C-TBD]
TP8  TESTPOINT  [TESTPOINT]  (value not drawn)
TP9  TESTPOINT  [TESTPOINT]  (value not drawn)
TP10  TESTPOINT  [TESTPOINT]  (value not drawn)
U4  STPM34  [32M1-A_L]
U5  PIC32MX795  [TQFP-PT64_N]
U6  STPM34  [32M1-A_L]
U7  23LCV1024  [SO8_L]
U8  STPM34  [32M1-A_L]
Y2  8Mhz  [CeramicResonator8-16MHZ]
Y3  16Mhz  [CeramicResonator8-16MHZ]

### Ports
BatVoltCheck, Ch1V+, Ch2V+, Ch3V+, Ch4V+, Ch5V+, Ch6V+, CH6V+, Ch7V+, Ch8V+, Ch9V+, Ch10V+, ChargerON, ChipSel, ChipSel1, CLK-SPI, CS_4, CS_5, CT7+, CT8+, CT9+, CT10+, ECRSDV, EMDC, Enable, ERXERR, InputVoltCheck, Int, MDIO, MISO, MOSI, MRESET, Phase_N, R4-Act, R6-Act, R8-Act, R10-Act, REFCLK, Relay7, Relay8, Relay9, Relay10, RxD0, RxD1, SCK, SDI, SDO, TxD0, TxD1, TxEN, Wake, Xtal2

### Nets
GND: C27.1 C28.2 C29.2 C30.2 C31.2 C32.2 C33.2 C34.2 C36.1 C37.2 C38.2 C39.2 C40.2 C41.2 C42.2 C44.2 C45.2 C46.2 C47.2 C49.2 C50.2 C51.2 C52.2 C53.2 C55.2 C56.2 C57.1 C59.2 C60.2 C61.2 C62.2 C63.2 C64.2 C67.1 C69.2 C70.2 C71.2 C72.1 C74.2 C75.2 C77.2 C78.2 C79.2 C80.2 C81.2 C82.2 C86.2 C87.2 C88.2 C89.2 D14.2(K) D15.2(K) L5.1 L6.1 L8.1 L9.1 L11.1 L12.1 L14.1 L15.1 L17.1 L18.1 L20.1 L21.1 M2.9(GND) P1.5 P2.23 P2.24 P3.11 P3.12 P3.13 Q3.E Q4.E Q5.E Q6.E Q7.E Q8.E R51.1 R56.1 R62.1 R71.1 R76.1 R81.1 U4.18(GND_REF) U4.20(GNDA) U4.22(GND_REG) U4.25(GNDD) U4.26(GNDD) U5.9(VSS) U5.20(AVSS) U5.25(VSS) U5.41(VSS) U6.18(GND_REF) U6.20(GNDA) U6.22(GND_REG) U6.25(GNDD) U6.26(GNDD) U7.3(WP) U7.4(GND) U8.18(GND_REF) U8.20(GNDA) U8.22(GND_REG) U8.25(GNDD) U8.26(GNDD) ; port Phase_N
VCC=3.3V: C29.1 C30.1 C31.1 C34.1 C37.1 C38.1 C40.1 C41.1 C44.1 C45.1 C56.1 C57.2 C74.1 C75.1 M2.1(VCC) M2.2(EN) P1.1 R43.2 R44.2 R59.2 R69.1 R70.1 R84.2 R86.2 U4.23(VCC) U5.10(VDD) U5.19(AVDD) U5.26(VDD) U5.38(VDD) U5.57(VDD) U6.23(VCC) U7.8(VCC) U8.23(VCC)
VCC=5V: P2.21 P2.22
NetC27_2: C27.2 C33.1 C39.1 U4.27(VDDD)
NetC28_1: C28.1 C32.1 C36.2 U4.21(VDDA)
NetC35_1: C35.1 R42.1 U4.12(IIN1)
NetC35_2: C35.2 R40.1 U4.11(IIP1)
NetC42_1: C42.1 R46.2 U5.40(OSC2) Y2.2(OSC2)
NetC43_1: C43.1 L6.2 R45.2 U4.10(VIN1)
NetC43_2: C43.2 P2.1 R45.1 U4.9(VIP1) ; port Ch1V+
NetC46_1: C46.1 U5.56(VCAP)
NetC47_1: C47.1 R46.1 U5.39(OSC1) Y2.1(OSC1)
NetC48_1: C48.1 R50.1 U4.14(IIN2)
NetC48_2: C48.2 R47.1 U4.13(IIP2)
NetC49_1: C49.1 R52.2 TP10.1 U4.3(XTAL1) Y3.2(OSC2)
NetC50_1: C50.1 C52.1 U4.19(VREF)
NetC51_1: C51.1 C53.1 U4.17(VREF1)
NetC54_1: C54.1 L9.2 R53.2 U4.16(VIP2)
NetC54_2: C54.2 P2.11 R53.1 U4.15(VIN2) ; port Ch2V+
NetC55_1: C55.1 R52.1 U4.2(XTAL2) Y3.1(OSC1)
NetC59_1: C59.1 C62.1 C63.1 U6.21(VDDA)
NetC60_1: C60.1 C61.1 C64.1 U6.27(VDDD)
NetC65#2_1: C65#2.1 R58.1 U6.12(IIN1)
NetC65#2_2: C65#2.2 R55.1 U6.11(IIP1)
NetC66_1: C66.1 L12.2 R61.2 U6.10(VIN1)
NetC66_2: C66.2 P2.3 R61.1 U6.9(VIP1) ; port Ch3V+
NetC67_2: C67.2 M2.15(RTS) P1.4 R59.1 U5.7(MCLR) ; port MRESET
NetC68_1: C68.1 R66.1 U6.14(IIN2)
NetC68_2: C68.2 R63.1 U6.13(IIP2)
NetC69_1: C69.1 C71.1 U6.19(VREF)
NetC70_1: C70.1 C72.2 U6.17(VREF1)
NetC73_1: C73.1 L15.2 R72.2 U6.16(VIP2)
NetC73_2: C73.2 P2.13 R72.1 U6.15(VIN2) ; port Ch4V+
NetC77_1: C77.1 C79.1 C81.1 U8.27(VDDD)
NetC78_1: C78.1 C80.1 C82.1 U8.21(VDDA)
NetC83_1: C83.1 R77.1 U8.12(IIN1)
NetC83_2: C83.2 R74.1 U8.11(IIP1)
NetC84_1: C84.1 L18.2 R78.2 U8.10(VIN1)
NetC84_2: C84.2 P2.5 R78.1 U8.9(VIP1) ; port Ch5V+
NetC85_1: C85.1 R83.1 U8.14(IIN2)
NetC85_2: C85.2 R80.1 U8.13(IIP2)
NetC86_1: C86.1 C88.1 U8.19(VREF)
NetC87_1: C87.1 C89.1 U8.17(VREF1)
NetC90_1: C90.1 L21.2 R85.2 U8.16(VIP2)
NetC90_2: C90.2 P2.15 R85.1 U8.15(VIN2) ; port Ch6V+, port CH6V+
NetC101_2: P2.7 ; port Ch7V+
NetC103_2: P2.17 ; port Ch8V+
NetC118_2: P2.9 ; port Ch9V+
NetC120_2: P2.19 ; port Ch10V+
NetD10_1: D10.1(A) R43.1
NetD10_2: D10.2(K) U4.5(LED2)
NetD11_1: D11.1(A) R44.1
NetD11_2: D11.2(K) U4.4(LED1)
NetD12_1: D12.1(A) R69.2
NetD12_2: D12.2(K) U6.4(LED1)
NetD13_1: D13.1(A) R70.2
NetD13_2: D13.2(K) U6.5(LED2)
NetD14_1: D14.1(A) R68.1
NetD15_1: D15.1(A) R67.1
NetD16_1: D16.1(A) R84.1
NetD16_2: D16.2(K) U8.4(LED1)
NetD17_1: D17.1(A) R86.1
NetD17_2: D17.2(K) U8.5(LED2)
NetL4_1: L4.1 P3.1
NetL4_2: L4.2 R40.2 R41.2
NetL5_2: L5.2 R41.1 R42.2
NetL7_1: L7.1 P3.2
NetL7_2: L7.2 R47.2 R49.2
NetL8_2: L8.2 R49.1 R50.2
NetL10_1: L10.1 P3.3
NetL10_2: L10.2 R55.2 R57.2
NetL11_2: L11.2 R57.1 R58.2
NetL13_1: L13.1 P3.4
NetL13_2: L13.2 R63.2 R64.2
NetL14_2: L14.2 R64.1 R66.2
NetL16_1: L16.1 P3.5
NetL16_2: L16.2 R74.2 R75.2
NetL17_2: L17.2 R75.1 R77.2
NetL19_1: L19.1 P3.6
NetL19_2: L19.2 R80.2 R82.2
NetL20_2: L20.2 R82.1 R83.2
NetL22_1: P3.7 ; port CT7+
NetL25_1: P3.8 ; port CT8+
NetL28_1: P3.9 ; port CT9+
NetM1_3: U5.43(IN2) ; port Wake
NetM1_4: U5.46(IN0) ; port Int
NetM1_5: U5.32(SDO4) U7.5(SI) ; port SDI
NetM1_6: U5.29(SCL4) U7.6(SCLK) ; port SCK
NetM1_7: U5.31(SDI4) U7.2(SO) ; port SDO
NetM1_8: U5.24(RB11/AN11) ; port ChipSel
NetM2_11: M2.11(RxD) TP9.1 U5.51(U1TX)
NetM2_12: M2.12(TxD) TP8.1 U5.50(U1RX)
NetP1_2: P1.2 U5.15(PGEC1)
NetP1_3: P1.3 U5.16(PGED1)
NetP2_2: P2.2 Q3.C
NetP2_4: P2.4 Q4.C
NetP2_6: P2.6 Q5.C
NetP2_8: P2.8 Q6.C
NetP2_10: P2.10 Q7.C
NetP2_12: P2.12 Q8.C
NetP2_14: P2.14 ; port R4-Act
NetP2_16: P2.16 ; port R6-Act
NetP2_18: P2.18 ; port R8-Act
NetP2_20: P2.20 ; port R10-Act
NetP3_10: P3.10 ; port CT10+
NetQ3_B: Q3.B R48.2 R51.2
NetQ4_B: Q4.B R54.2 R56.2
NetQ5_B: Q5.B R60.2 R62.2
NetQ6_B: Q6.B R65.2 R71.2
NetQ7_B: Q7.B R73.2 R76.2
NetQ8_B: Q8.B R79.2 R81.2
NetR3_1: U5.23(RB10/AN10) ; port InputVoltCheck
NetR12_1: U5.22(RB9/An9) ; port BatVoltCheck
NetR13_2: U5.33(USBID/RF3) ; port ChargerON
NetR22_1: U5.49(EMDIO) ; port MDIO
NetR29_2: U5.61(ERXD0) ; port RxD0
NetR30_2: U5.60(ERXD1) ; port RxD1
NetR31_2: U5.44(IN3) ; port ECRSDV
NetR32_2: U5.64(ERXERR) ; port ERXERR
NetR35_2: U5.63(ERXCLK) ; port REFCLK
NetR48_1: R48.1 U5.59(RF1)
NetR54_1: R54.1 U5.58(RF0)
NetR65_1: R65.1 U5.54(RD6)
NetR67_2: R67.2 U5.42(IN1)
NetR68_2: R68.2 U5.28(RB13)
NetR73_1: R73.1 U5.53(RD5)
NetR79_1: R79.1 U5.52(RD4)
NetR91_1: U5.48(RC14) ; port Relay7
NetU3_13: U5.30(EMDC) ; port EMDC
NetU3_16: U5.1(ETXEN) ; port TxEN
NetU3_17: U5.2(ETXD0) ; port TxD0
NetU3_18: U5.3(ETXD1) ; port TxD1
NetU4_1: U4.1(CLKOUT) U6.2(XTAL2)
NetU4_8: U4.8(EN) U5.45(IN4) U6.8(EN) U8.8(EN) ; port Enable
NetU4_29: U4.29(SCS) U5.8(RG9)
NetU4_30: U4.30(SCL) U5.4(SCK2) U6.30(SCL) U8.30(SCL) ; port CLK-SPI
NetU4_31: U4.31(MOSI) U5.6(SDO2) U6.31(MOSI) U8.31(MOSI) ; port MOSI
NetU4_32: U4.32(MISO) U5.5(SDI2) U6.32(MISO) U8.32(MISO) ; port MISO
NetU5_11: U5.11(RG5/AN5) U6.29(SCS)
NetU5_12: U5.12(RB4/AN4) U8.29(SCS)
NetU5_13: U5.13(RB3/AN3) ; port CS_5
NetU5_14: U5.14(RB2/AN2) ; port CS_4
NetU5_17: U5.17(RB6/AN6) ; port ChipSel1
NetU5_18: U5.18(RB7/AN7) ; port Relay10
NetU5_21: U5.21(RB8/AN8) ; port Relay9
NetU5_27: U5.27(RB12) U7.1(CS)
NetU5_47: U5.47(RC13) ; port Relay8
NetU6_1: U6.1(CLKOUT) U8.2(XTAL2)
NetU8_1: U8.1(CLKOUT) ; port Xtal2

Not connected (* = marked no-connect by the designer): C65#1 1 2; M2 3(GPIO2) 4(GPIO8); R60 1; U4 6(INT1) 7(INT2) 24(NC) 28(SYN); U5 34(VBUS) 35(VUSB) 36(D-/RG3) 37(D+/RG2) 55(RD7) 62(ERXDIV); U6 3(XTAL1) 6(INT1) 7(INT2) 24(NC) 28(SYN); U7 7(HOLD); U8 3(XTAL1) 6(INT1) 7(INT2) 24(NC) 28(SYN)

### Notes on the sheet
- Channel01
- CurrentTrans1+
- (near R40) 1%
- (near R40) .125W
- (near L5) /1%
- /.125W
- /1%/.125W
- (near R43) .125W
- (near R43) 1%
- (near R44) .125W
- (near R44) 1%
- CurrentTrans2+
- Channel02
- (near R47) 1%
- (near R47) .125W
- (near R46) .125W
- (near R46) 1%
- (near L8) /1%
- (near R48) /1%
- (near R48) /.125W
- (near R52) .125W
- (near R51) /1%
- (near R51) /.125W
- (near R52) 1%
- (near P3) CurrTr1+
- (near L10) CurrentTrans3+
- (near L9) Channel03
- (near R55) 1%
- (near R55) .125W
- (near R54) /1%
- (near R54) /.125W
- (near P3) CurrTr3+
- (near P3) CurrTr4+
- (near P3) CurrTr2+
- (near P3) CurrTr5+
- (near P3) CurrTr6+
- (near L11) /1%
- (near R56) /1%
- (near R56) /.125W
- (near R60) /1%
- (near R60) /.125W
- (near R62) /1%
- (near R62) /.125W
- (near L13) CurrentTrans4+
- (near R63) 1%
- (near R63) .125W
- (near L14) /1%
- (near R69) 1%
- (near R70) 1%
- (near R68) .125W
- (near R68) 1%
- (near R67) .125W
- (near R67) 1%
- (near R65) /1%
- (near R65) /.125W
- (near R69) .125W
- (near R70) .125W
- Status Codes
- (near R71) /1%
- (near R71) /.125W
- CurrentTrans5+
- (near R74) 1%
- (near R74) .125W
- (near L17) /1%
- (near R76) /1%
- (near R73) /1%
- (near R76) /.125W
- (near R73) /.125W
- CurrentTrans6+
- (near R80) 1%
- (near R80) .125W
- (near R79) /1%
- (near R79) /.125W
- (near L20) /1%
- (near R81) /1%
- (near R81) /.125W
- (near R84) 1%
- (near R84) .125W
- (near R86) 1%
- (near R86) .125W

### Library data of the parts
C27 C30 C52 C53 C57 C60 C63 C71 C72 C75 C77 C82 C88 C89 = 0805C-18PF-50V-C0G-JOH: CAPACITOR 0805 CERAMIC; mfr PN: LMK105BJ104KV-F; Manufacturer: Taiyo Yuden; Mfr.PN#: CRM155R71H103KA880; Value: 100nF/16V; Suppl.PN#: 587-1227-1-ND; Supplier 1: Digi-Key; Supplier Part Number 1: 709-1171-2-ND; Supplier: Digi-Key; smd: 0402; Price: .002
  C27: Package reference: 0402
  C30 C52 C53 C57 C60 C63 C71 C72 C75 C77 C82 C88 C89: Package reference: 0805-TBD
C28 C59 C64 C78 C81 = Cap: Capacitor; Manufacturer: Murata; Mfr.PN#: GRM155R60J105KE19D; Value: 1uF; Suppl.PN#: 490-1320-1-ND; Published: 8-Jun-2000; LatestRevisionDate: 17-Jul-2002; LatestRevisionNote: Re-released for DXP Platform.; PackageReference: RAD-0.3; Publisher: Altium Limited; PackageDescription: Radial Cap, Thru-Hole; 2 Leads; 0.3 in Pin Spacing; Supplier: DigiKey
C29 C32 C33 C56 C61 C62 C74 C79 C80 = 0805C-18PF-50V-C0G-JOH: CAPACITOR 0805 CERAMIC; Manufacturer: Wurth Electronics; Mfr.PN#: 885012005014; Suppl.PN#: 732-7432-1-ND; Supplier 1: Digi-Key; Supplier Part Number 1: 709-1171-2-ND; Value: 150pF/10V; mfr PN: *; Supplier: Digi-Key; smd: 0402; Price: .002
  C29 C32 C56 C61 C62 C74 C79 C80: Package reference: 0805-TBD
  C33: Package reference: 0402
C31 = Cap Pol3: Polarized Capacitor (Surface Mount); Manufacturer: Nichicon; Mfr.PN#: RL80J471MDNASQKX; Value: 100uF/10v; Suppl.PN#: 493-4019-3-ND; Published: 8-Jun-2000; LatestRevisionDate: 29-May-2009; LatestRevisionNote: IPC-7351 Footprint Added.; PackageReference: C0805; Publisher: Altium Limited; PackageDescription: Chip Capacitor; Supplier: Digi-Key; SMD: 1206; Price: .065
C34 C37 C40 C41 C44 C45 = 0805C-18PF-50V-C0G-JOH: CAPACITOR 0805 CERAMIC; Manufacturer: Murata Electronnics; Mfr.PN#: GRM155R61A104KA01; Value: 10n; Suppl.PN#: 490-1318-2-ND; Pprice: 0.0021; Supplier 1: Digi-Key; Supplier Part Number 1: 709-1171-2-ND; mfr PN: *; Package reference: 0805-TBD; Supplier: Digi-Key; SMD: 0402
C35 C43 C48 C54 C65#1 C65#2 C66 C68 C73 C83-C85 C90 = 0805C-18PF-50V-C0G-JOH: CAPACITOR 0805 CERAMIC; Manufacturer: Murata Electronics; Mfr.PN#: GRM155R71C103KA01D; Value: 10n; Suppl.PN#: 490-1313-1-ND; Supplier 1: Digi-Key; Supplier Part Number 1: 709-1171-2-ND; mfr PN: *; Supplier: Digi-Key; smd: 0402; Price: .002
  C35 C43 C48 C54 C65#1 C66 C68 C73 C83-C85 C90: Package reference: 0402; Suppl.PN#: GRM155R71C103KA01D
  C65#2: Package reference: 0805-TBD
C36 = 0805C-18PF-50V-C0G-JOH: CAPACITOR 0805 CERAMIC; mfr PN: LMK105BJ104KV-F; Manufacturer: Taiyo Yuden; Mfr.PN#: CRM155R71H103KA880; Suppl.PN#: 587-1227-1-ND; Supplier 1: Digi-Key; Supplier Part Number 1: 709-1171-2-ND; Value: 100nF/10V; Package reference: 0805-TBD; Supplier: Digi-Key; smd: 0402; Price: .002
C38 C46 = Cap: as C9 on sheet Sheet1-multi; Published: 8-Jun-2000; LatestRevisionDate: 17-Jul-2002; LatestRevisionNote: Re-released for DXP Platform.; PackageReference: 0402; Publisher: Altium Limited; PackageDescription: Radial Cap, Thru-Hole; 2 Leads; 0.3 in Pin Spacing; Supplier: Digi-Key; Price: .049; Footprint: 0603
C39 = Cap: Capacitor; Manufacturer: Samsung; Mfr.PN#: CL05A475MO5NUNC; Value: 1uF; Suppl.PN#: 1276-6836-1-ND; Published: 8-Jun-2000; LatestRevisionDate: 17-Jul-2002; LatestRevisionNote: Re-released for DXP Platform.; PackageReference: RAD-0.3; Publisher: Altium Limited; PackageDescription: Radial Cap, Thru-Hole; 2 Leads; 0.3 in Pin Spacing; Supplier: DigiKey
C42 C47 = 0805C-18PF-50V-C0G-JOH: CAPACITOR 0805 CERAMIC; Manufacturer: Murata; Mfr.PN#: GRM1555C1H180JA01D; Suppliier: DigiKey; Suppl.PN#: 490-5858-1-ND; Supplier 1: Digi-Key; Supplier Part Number 1: 709-1171-2-ND
C49 C55 = 0805C-18PF-50V-C0G-JOH: CAPACITOR 0805 CERAMIC; Manufacturer: Kemet; Mfr.PN#: C0402C150J4GACTU; Suppl.PN#: 399-8947-2-ND; Supplier 1: Digi-Key; Supplier Part Number 1: 709-1171-2-ND; Supplier: Digi-Key; Price: .00987; SMD: 0402
C50 C51 C69 C70 C86 C87 = 0805C-18PF-50V-C0G-JOH: CAPACITOR 0805 CERAMIC; Manufacturer: Wurth Electronics; Mfr.PN#: 885012005014; Value: 150pF/10V; Suppl.PN#: 732-7432-1-ND; Supplier 1: Digi-Key; Supplier Part Number 1: 709-1171-2-ND; mfr PN: *; Package reference: 0805-TBD; Supplier: Digi-Key; smd: 0402; Price: .002
C67 = 0805C-18PF-50V-C0G-JOH: CAPACITOR 0805 CERAMIC; Manufacturer: Samsung; Mfr.PN#: CL05B104KO5NNC; Suppl.PN#: 1276-1001-2-ND; Supplier 1: Digi-Key; Supplier Part Number 1: 709-1171-2-ND; Supplier: Digi-Key; Price: .00206; SMD: 0402
D10-D17 = LED2: as D2 on sheet Sheet1-multi; Published: 8-Jun-2000; LatestRevisionDate: 17-Jul-2002; LatestRevisionNote: Re-released for DXP Platform.; PackageVersion: Feb-2002; PackageReference: 3.2X1.6X1.1; Publisher: Altium Limited; PackageDescription: SM LED; 2 Flat Leads; Supplier: Digi-Key; Price: .04
L4-L21 = FerrBeads/ILBB: Manufacturer: Brand Samsung; Mfr.PN#: C1M10J152NC; Suppl.PN#: 1276-6326-1-ND; Supplier: Digi-Key; Price: .027
P1 = Header 5: Header, 5-Pin; LatestRevisionDate: 17-Jul-2002; LatestRevisionNote: Re-released for DXP Platform.; Publisher: Altium Limited; Supplier: Optional depend of debugger
P2 = Header 24: Header, 24-Pin; Manufacturer: Guagdong, China; Mfr.PN#: PH2.54-A201; LatestRevisionDate: 17-Jul-2002; LatestRevisionNote: Re-released for DXP Platform.; Publisher: Altium Limited; Supplier: https://www.alibaba.com/product-detail/single-row-straight-24pin-female-header_925058879.html?spm=a2700.7724857.0.0.hZcBsz
P3 = Header 13: Header, 13-Pin; LatestRevisionDate: 17-Jul-2002; LatestRevisionNote: Re-released for DXP Platform.; Publisher: Altium Limited
Q3-Q8 = MMBT2222: as Q2 on sheet Sheet1-multi; Supplier 1: Digi-Key; Supplier Part Number 1: MMBT2222A-FDICT-ND; Supplier: Digi-Key; Package: SOT-323; Price: .03
R40 R42 R47 R50 R55 R58 R63 R66 R74 R77 R80 R83 = Res3: as R9 on sheet Sheet1-multi; Published: 8-Jun-2000; LatestRevisionDate: 29-May-2009; LatestRevisionNote: IPC-7351 Footprint Added.; PackageReference: 0805; Publisher: Altium Limited; PackageDescription: Chip Resistor; Value: 1K; Supplier: DigiKey; Price: .0035
R41 R49 R57 R64 R75 R82 = Res3: Resistor; Manufacturer: Panasonic; Mfr.PN#: ERJ-2RKF18R7X; Value: 18.7 1%; Suppl.PN#: P18.7LCT-ND; Published: 8-Jun-2000; LatestRevisionDate: 29-May-2009; LatestRevisionNote: IPC-7351 Footprint Added.; PackageReference: J1-0603; Publisher: Altium Limited; PackageDescription: Chip Resistor; Supplier: Digi-Key; Price: .05; SMD: 0805
R43 R44 R67-R70 R84 R86 = Res3: Resistor; Manufacturer: Panasonic; Mfr.PN#: ERJ-2RKF2200X; Value: 1K 1%; Suppl.PN#: P220LCT-ND; Published: 8-Jun-2000; LatestRevisionDate: 29-May-2009; LatestRevisionNote: IPC-7351 Footprint Added.; PackageReference: J1-0603; Publisher: Altium Limited; PackageDescription: Chip Resistor; manufacture P/N: *; Supplier: Digi-Key; Price: .0027
R45 R53 R61 R72 R78 R85 = Res3: Resistor; Manufacturer: Panasonic Co; Mfr.PN#: ERJ-P06F6650V; Value: 470 1%/.250W; Suppl.PN#: RMCF1206FT470RDKR-ND; Published: 8-Jun-2000; LatestRevisionDate: 29-May-2009; LatestRevisionNote: IPC-7351 Footprint Added.; PackageReference: J1-0603; Publisher: Altium Limited; PackageDescription: Chip Resistor; Supplier: Digi-Key; SMD: 1206; Price: .02
R46 = Res3: Resistor; Manufacturer: Panasonic; Mfr.PN#: ERJ-2RKF1004X; Value: 1K 1%; Suppl.PN#: P1.00MLTR-ND; Published: 8-Jun-2000; LatestRevisionDate: 29-May-2009; LatestRevisionNote: IPC-7351 Footprint Added.; PackageReference: J1-0603; Publisher: Altium Limited; PackageDescription: Chip Resistor; manufacture P/N: *; Supplier: Digi-Key; Price: .0027
R48 R54 R60 R65 R73 R79 = Res3: Resistor; Manufacturer: Panasonic; Mfr.PN#: ERJ-2RKF4700X; Value: 470/.125W/1%; Suppl.PN#: P470LCT-ND; Published: 8-Jun-2000; LatestRevisionDate: 29-May-2009; LatestRevisionNote: IPC-7351 Footprint Added.; PackageReference: J1-0603; Publisher: Altium Limited; PackageDescription: Chip Resistor; Supplier: Digi-Key; Price: .003
R51 R56 R62 R71 R76 R81 = Res3: Resistor; Manufacturer: Panasonic; Mfr.PN#: ERJ-2RKF2001X; Value: 2K/.125W/1%; Suppl.PN#: P2.00KLDKR-ND; Published: 8-Jun-2000; LatestRevisionDate: 29-May-2009; LatestRevisionNote: IPC-7351 Footprint Added.; PackageReference: J1-0603; Publisher: Altium Limited; PackageDescription: Chip Resistor; Supplier: Digi-Key; Price: .033
R52 = Res3: Resistor; Manufacturer: Stackpole Electronics; Mfr.PN#: RMCF0805FT1M00; Value: 1K 1%; Suppl.PN#: RMCF0805FT1M00TR-ND; Published: 8-Jun-2000; LatestRevisionDate: 29-May-2009; LatestRevisionNote: IPC-7351 Footprint Added.; PackageReference: J1-0603; Publisher: Altium Limited; PackageDescription: Chip Resistor; manufacture P/N: *; Supplier: Digi-Key; Price: .0027
R59 = Res3: as R6 on sheet Sheet1-multi; Published: 8-Jun-2000; LatestRevisionDate: 29-May-2009; LatestRevisionNote: IPC-7351 Footprint Added.; PackageReference: 0805; Publisher: Altium Limited; PackageDescription: Chip Resistor; Supplier: Digi-Key; Price: .0035
TP8-TP10 = TESTPOINT: as TP3 on sheet Sheet1-multi; Supplier 1: Digi-Key; Supplier Part Number 1: 5010K-ND
U4 U6 U8 = STPM34: Manufacturer: STMicroelectronic; Mfr.PN#: STPM34TR; Suppl.PN#: 497-14670-1-ND; Supplier: Digi-Key; Price: 1.16
U5 = PIC32MX534F064F: Manufacturer: Microchip; Mfr.PN#: PIC32MX795F512H-80I/PT; Suppl.PN#: 1778989; Supplier: Farnel; Price: 5.16
U7 = 23LCV1024: Manufacturer: Microchip; Mfr.PN#: 23LCV1024-I/SN; Suppl.PN#: 23LCV1024-I/SN-ND; Supplier: DigiKey
Y2 = XTAL: Crystal Oscillator; Manufacturer: AuxCorp/Kyocera Corp.; Mfr.PN#: ABLS-8.000MHZB4-T; Suppl.PN#: 478-2110-1-ND; Published: 8-Jun-2000; LatestRevisionDate: 17-Jul-2002; LatestRevisionNote: Re-released for DXP Platform.; PackageReference: PBRC-H; Publisher: Altium Limited; PackageDescription: Crystal, Thru-Hole; 2 Leads; Body 3.1 x 8.2 mm (Dia.xH); Supplier: Digi-Key; Price: .137
Y3 = XTAL: Crystal Oscillator; Manufacturer: Abracon; Mfr.PN#: ABLS3-16.000MHz-D4Y-T; Suppl.PN#: 1253-1084-2-ND; Published: 8-Jun-2000; LatestRevisionDate: 17-Jul-2002; LatestRevisionNote: Re-released for DXP Platform.; PackageReference: R38; Publisher: Altium Limited; PackageDescription: Crystal, Thru-Hole; 2 Leads; Body 3.1 x 8.2 mm (Dia.xH); Supplier: Digi-Key; Price: .288